# Altium project SlimeVR_REVTT.PrjPcb
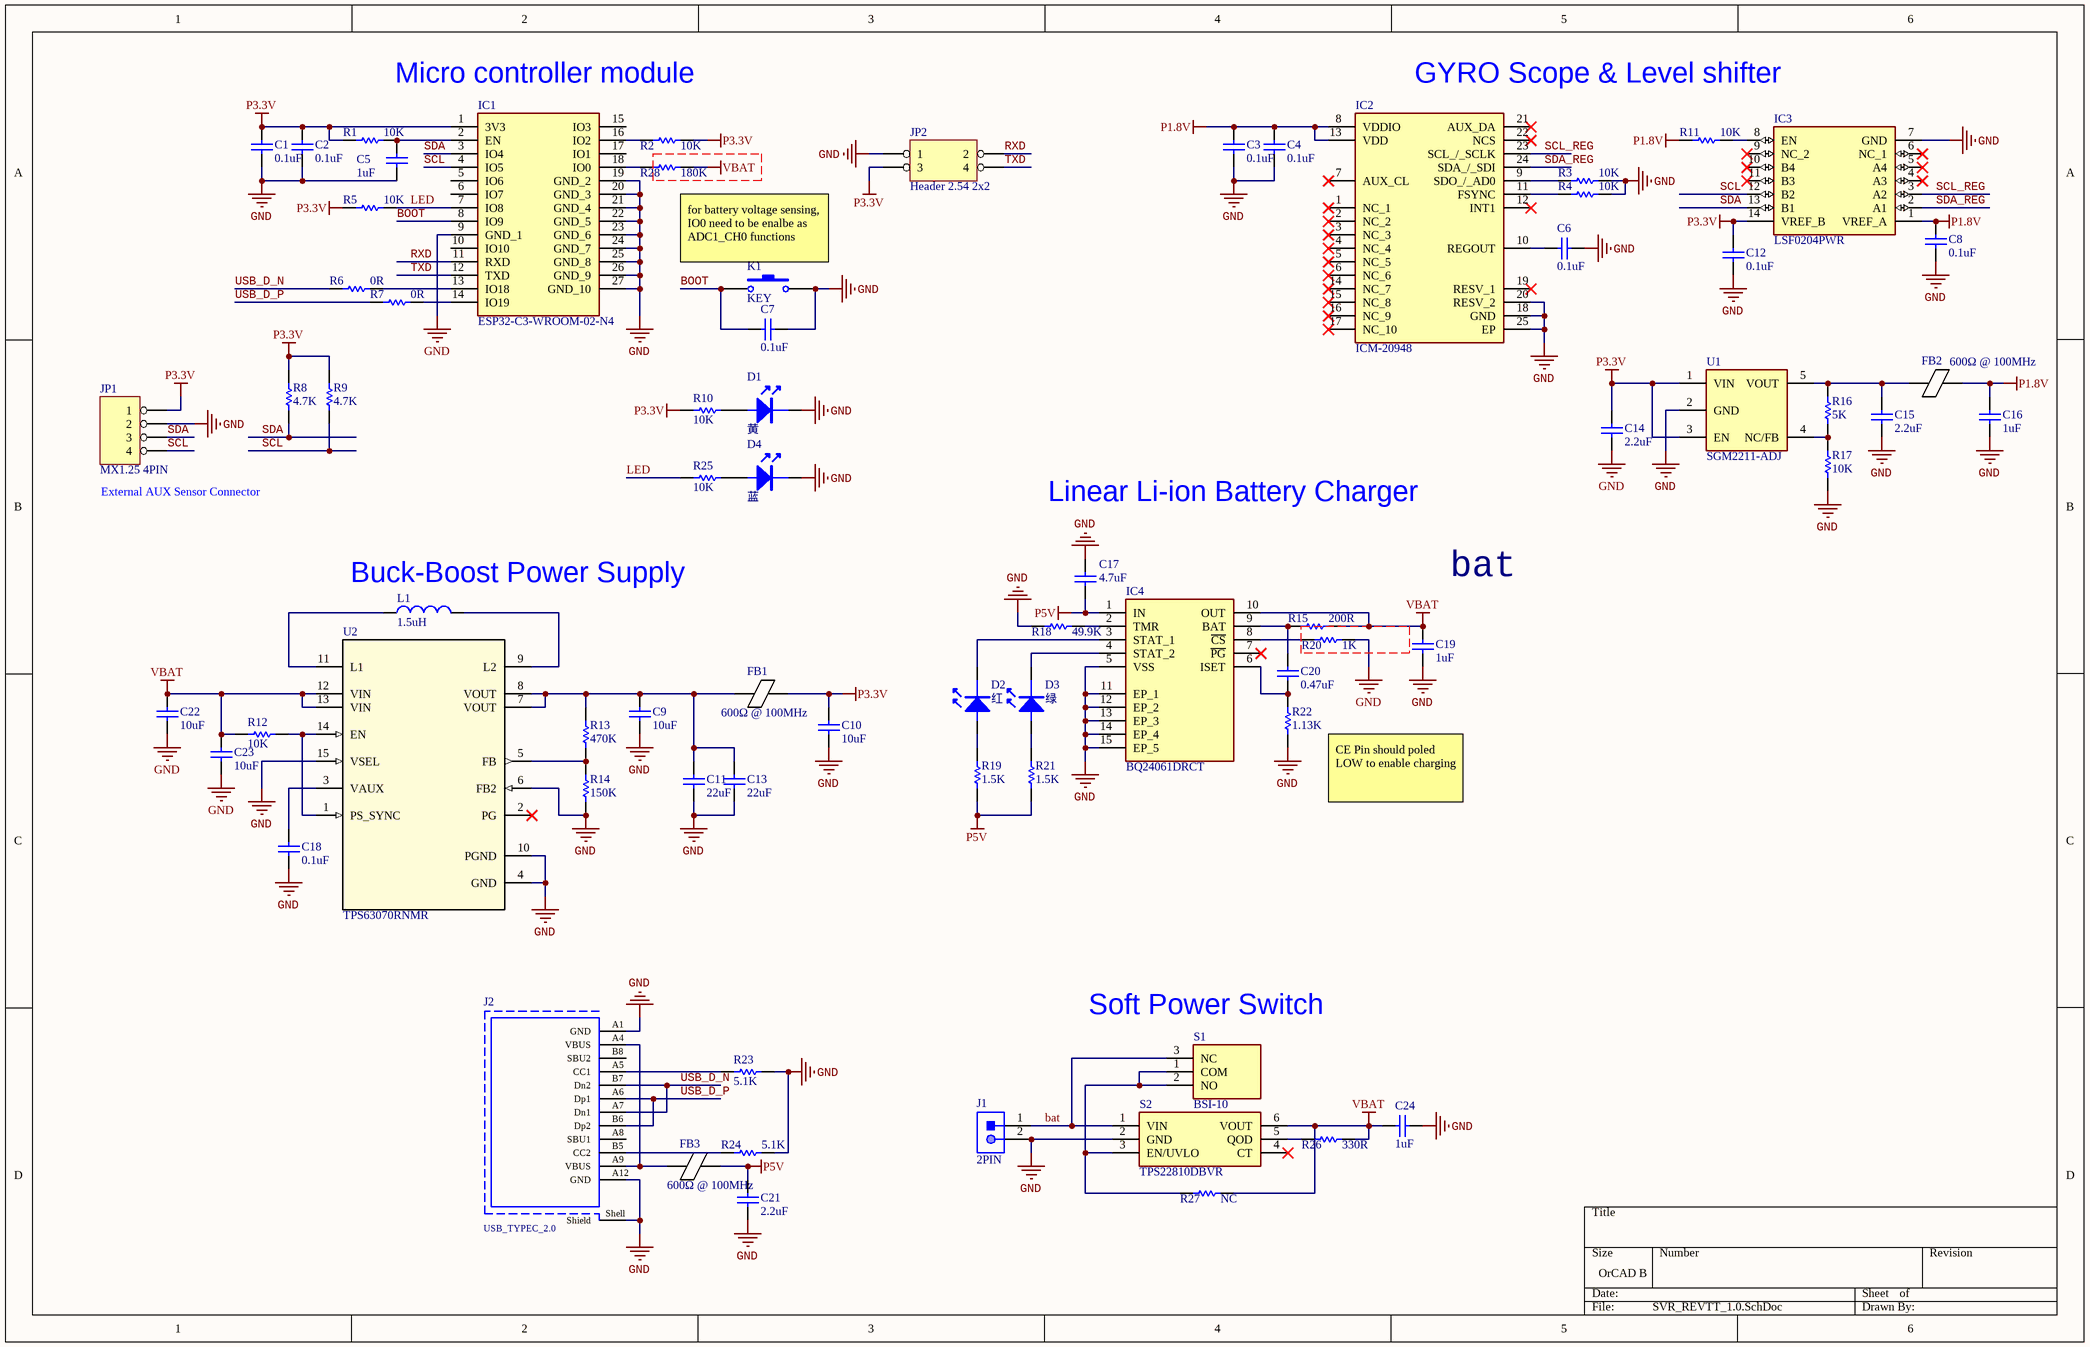
[diagram p0: SVR_REVTT_1.0.SchDoc]
1 sheet, 73 parts. Net scope: global (net labels, ports and power ports of the same name join across sheets).
Board file: SLMVR_REVTT.PcbDoc

## Sheet SVR_REVTT_1.0.SchDoc
size OrCAD B

### Parts
C1  0.1uF  [0603_C]
C2  0.1uF  [0603_C]
C3  0.1uF  [0603_C]
C4  0.1uF  [0603_C]
C5  1uF  [0603_C]
C6  0.1uF  [0603_C]
C7  0.1uF  [0603_C]
C8  0.1uF  [0603_C]
C9  10uF  [0603_C]
C10  10uF  [0805]
C11  22uF  [0805]
C12  0.1uF  [0603_C]
C13  22uF  [0805]
C14  2.2uF  [0603_C]
C15  2.2uF  [0603_C]
C16  1uF  [0603_C]
C17  4.7uF  [0603_C]
C18  0.1uF  [0603_C]
C19  1uF  [0603_C]
C20  0.47uF  [0603_C]
C21  2.2uF  [0603_C]
C22  10uF  [0805]
C23  10uF  [0805]
C24  1uF  [0603_C]
D1  黄  [0603_LED]
D2  红  [0603_LED]
D3  绿  [0603_LED]
D4  蓝  [0603_LED]
FB1  600Ω @ 100MHz  [0805]
FB2  600Ω @ 100MHz  [0603]
FB3  600Ω @ 100MHz  [0603]
IC1  ESP32-C3-WROOM-02-N4  [ESP32C3WROOM02N4]
IC2  ICM-20948  [QFN40P300X300X105-25N-D]
IC3  LSF0204PWR  [SOP65P640X120-14N]
IC4  BQ24061DRCT  [BQ24060DRCT]
J1  2PIN  [XH2.54-WI-2P]
J2  USB_TYPEC_2.0  [USB_TYPEC_2.0_Horizontal_SMT]
JP1  MX1.25 4PIN  [MX 1.25-WS-4P]
JP2  Header 2.54 2x2  [header2X2]
K1  KEY  [KEY_2]
L1  value 1.5uH  [L 1812]  (hidden comment: INDUCTOR)
R1  10K  [0603_R]
R2  10K  [0603_R]
R3  10K  [0603_R]
R4  10K  [0603_R]
R5  10K  [0603_R]
R6  0R  [0603_R]
R7  0R  [0603_R]
R8  4.7K  [0603_R]
R9  4.7K  [0603_R]
R10  10K  [0603]
R11  10K  [0603_R]
R12  10K  [0603_R]
R13  470K  [0603_R]
R14  150K  [0603_R]
R15  200R  [0603_R]
R16  5K  [0603]
R17  10K  [0603]
R18  49.9K  [0603_R]
R19  1.5K  [0603_R]
R20  1K  [0603_R]
R21  1.5K  [0603_R]
R22  1.13K  [0603_R]
R23  5.1K  [0603]
R24  5.1K  [0603]
R25  10K  [0603]
R26  330R  [0603_R]
R27  NC  [0805]
R28  180K  [0603_R]
S1  BSI-10  [BSI10]
S2  TPS22810DBVR  [SOT95P280X145-6N]
U1  SGM2211-ADJ  [SOT-23-5]
U2  TPS63070RNMR  [RNM0015A]

### Nets
GND: C1.1 C2.1 C3.2 C4.2 C5.1 C6.1 C7.2 C8.2 C9.1 C10.1 C11.1 C12.2 C13.1 C14.1 C15.1 C16.1 C17.1 C18.2 C19.2 C21.1 C22.1 C23.1 C24.2 D1.1(K) D4.1(K) IC1.9(GND_1) IC1.19(GND_2) IC1.20(GND_3) IC1.21(GND_4) IC1.22(GND_5) IC1.23(GND_6) IC1.24(GND_7) IC1.25(GND_8) IC1.26(GND_9) IC1.27(GND_10) IC2.18(GND) IC2.20(RESV_2) IC2.25(EP) IC3.7(GND) IC4.5(VSS) IC4.11(EP_1) IC4.12(EP_2) IC4.13(EP_3) IC4.14(EP_4) IC4.15(EP_5) J1.2 J2.A1(GND) J2.A12(GND) J2.Shell(Shield) JP1.2 JP2.1 K1.2 R3.2 R4.2 R14.2 R17.1 R18.2 R20.1 R22.1 R23.2 R24.2 S2.2(GND) U1.2(GND) U2.4(GND) U2.6(FB2) U2.10(PGND) U2.15(VSEL)
P1.8V: C3.1 C4.1 C8.1 C16.2 FB2.2 IC2.8(VDDIO) IC2.13(VDD) IC3.1(VREF_A) R11.1
P3.3V: C1.2 C2.2 C10.2 C12.1 C14.2 FB1.2 IC1.1(3V3) IC3.14(VREF_B) JP1.1 JP2.3 R1.1 R2.2 R5.1 R8.2 R9.2 R10.1 U1.1(VIN) U1.3(EN)
P5V: C17.2 C21.2 FB3.2 IC4.1(IN) R19.2 R21.2
VBAT: C19.1 C22.2 C23.2 C24.1 IC4.10(OUT) R12.2 R15.1 R26.2 R27.2 R28.2 S2.6(VOUT) U2.12(VIN) U2.13(VIN)
bat: J1.1 S1.3(NC) S2.1(VIN)
BOOT: C7.1 IC1.8(IO9) K1.1
LED: IC1.7(IO8) R5.2 R25.1
RXD: IC1.11(RXD) JP2.2
SCL: IC1.4(IO5) IC3.12(B2) JP1.4 R9.1
SCL_REG: IC2.23(SCL_/_SCLK) IC3.3(A2)
SDA: IC1.3(IO4) IC3.13(B1) JP1.3 R8.1
SDA_REG: IC2.24(SDA_/_SDI) IC3.2(A1)
TXD: IC1.12(TXD) JP2.4
USB_D_N: J2.A7(Dn1) J2.B7(Dn2) R6.1
USB_D_P: J2.A6(Dp1) J2.B6(Dp2) R7.1
NetC5_2: C5.2 IC1.2(EN) R1.2
NetC6_2: C6.2 IC2.10(REGOUT)
NetC9_2: C9.2 C11.2 C13.2 FB1.1 R13.1 U2.7(VOUT) U2.8(VOUT)
NetC15_2: C15.2 FB2.1 R16.2 U1.5(VOUT)
NetC18_1: C18.1 U2.3(VAUX)
NetC20_1: C20.1 IC4.6(ISET) R22.2
NetC20_2: C20.2 IC4.9(BAT) R15.2
NetD1_2: D1.2(A) R10.2
NetD2_1: D2.1(K) IC4.3(STAT_1)
NetD2_2: D2.2(A) R19.1
NetD3_1: D3.1(K) IC4.4(STAT_2)
NetD3_2: D3.2(A) R21.1
NetD4_2: D4.2(A) R25.2
NetFB3_1: FB3.1 J2.A4(VBUS) J2.A9(VBUS)
NetIC1_13: IC1.13(IO18) R6.2
NetIC1_14: IC1.14(IO19) R7.2
NetIC1_16: IC1.16(IO2) R2.1
NetIC1_18: IC1.18(IO0) R28.1
NetIC2_9: IC2.9(SDO_/_AD0) R3.1
NetIC2_11: IC2.11(FSYNC) R4.1
NetIC3_8: IC3.8(EN) R11.2
NetIC4_2: IC4.2(TMR) R18.1
NetIC4_8: IC4.8(~{CS}) R20.2
NetJ2_A5: J2.A5(CC1) R23.1
NetJ2_B5: J2.B5(CC2) R24.1
NetL1_1: L1.1 U2.11(L1)
NetL1_2: L1.2 U2.9(L2)
NetR12_1: R12.1 U2.1(PS_SYNC) U2.14(EN)
NetR13_2: R13.2 R14.1 U2.5(FB)
NetR16_1: R16.1 R17.2 U1.4(NC/FB)
NetR26_1: R26.1 S2.5(QOD)
NetR27_1: R27.1 S1.1(COM) S1.2(NO) S2.3(EN/UVLO)

Not connected (* = marked no-connect by the designer): IC1 5(IO6) 6(IO7) 10(IO10) 15(IO3) 17(IO1); IC2 1(NC_1)* 2(NC_2)* 3(NC_3)* 4(NC_4)* 5(NC_5)* 6(NC_6)* 7(AUX_CL)* 12(INT1)* 14(NC_7)* 15(NC_8)* 16(NC_9)* 17(NC_10)* 19(RESV_1)* 21(AUX_DA)* 22(NCS)*; IC3 4(A3)* 5(A4)* 6(NC_1)* 9(NC_2)* 10(B4)* 11(B3)*; IC4 7(~{PG})*; J2 A8(SBU1) B8(SBU2); S2 4(CT)*; U2 2(PG)*

### Notes on the sheet
- Micro controller module
- GYRO Scope & Level shifter
- for battery voltage sensing, IO0 need to be enalbe as ADC1_CH0 functions
- (near JP1) External AUX Sensor Connector
- Linear Li-ion Battery Charger
- (near L1) Buck-Boost Power Supply
- bat
- (near R22) CE Pin should poled LOW to enable charging
- (near S1) Soft Power Switch

### Library data of the parts
C1-C24 = CAP: Capacitor; Value: 104; Published: 8-Jun-2000; LatestRevisionDate: 17-Jul-2002; LatestRevisionNote: Re-released for DXP Platform.; PackageReference: RAD-0.3; Publisher: Altium Limited
D1-D4 = LED: LED 发光二极管
FB1-FB3 = FB: 磁珠 600Ω @ 100MHz
IC1 = ESP32-C3-WROOM-02-N4: Integrated Circuit; Manufacturer_Name: Espressif Systems; Datasheet Link: https://www.mouser.ch/datasheet/2/891/Espressif_ESP32_C3_WROOM_02-2006871.pdf; Height: 3.35mm; Manufacturer_Part_Number: ESP32-C3-WROOM-02-N4; Mouser Part Number: 356-ESP32C3WROOM02N4; Mouser Price/Stock: https://www.mouser.co.uk/ProductDetail/Espressif-Systems/ESP32-C3-WROOM-02-N4?qs=stqOd1AaK7%2FqjTZKEOgfUg%3D%3D
IC2 = ICM-20948: Integrated Circuit; Manufacturer_Name: TDK; Datasheet Link: https://product.tdk.com/system/files/dam/doc/product/sensor/mortion-inertial/imu/data_sheet/ds-000189-icm-20948-v1.3.pdf; Height: 1.05mm; Manufacturer_Part_Number: ICM-20948; Mouser Part Number: 410-ICM-20948; Mouser Price/Stock: https://www.mouser.co.uk/ProductDetail/TDK-InvenSense/ICM-20948?qs=u4fy%2FsgLU9OtGc31yF%2Friw%3D%3D; Arrow Part Number: ICM-20948; Arrow Price/Stock: https://www.arrow.com/en/products/icm-20948/invensense?region=nac
IC3 = LSF0204PWR: Integrated Circuit; Manufacturer_Name: Texas Instruments; Datasheet Link: http://www.ti.com/lit/gpn/lsf0204; Height: 1.2mm; Manufacturer_Part_Number: LSF0204PWR; Mouser Part Number: 595-LSF0204PWR; Mouser Price/Stock: https://www.mouser.co.uk/ProductDetail/Texas-Instruments/LSF0204PWR?qs=m%2F7bTylgptck0MkFZrWcVg%3D%3D; Arrow Part Number: LSF0204PWR; Arrow Price/Stock: https://www.arrow.com/en/products/lsf0204pwr/texas-instruments?region=nac
IC4 = BQ24060DRCT: Integrated Circuit; Manufacturer_Name: Texas Instruments; Datasheet Link: https://www.ti.com/lit/gpn/bq24060; Height: 1mm; Manufacturer_Part_Number: BQ24060DRCT
J1 = HEADER 2PIN
J2 = USB_TYPEC_2.0: USB 3.1 Type C Receptacle WR-COM, Horizontal, SMT / THT; Part Number: 632723300011; Rated Current: 5 A; Contact Resistance: 30 mOhm; Working Voltage: 20 VDC; ComponentLink1Description: Manufacturer; ComponentLink1URL: http://www.we-online.de; ComponentLink2Description: Datasheet; ComponentLink2URL: https://katalog.we-online.de/em/datasheet/632723x00011%282%29.pdf; Published Date: September 2018; Publisher: Wurth Elektronik; Orientation: Horizontal; Connector Type: USB 3.1 Type C; Operating Temperature: -40 to 105 degC; Mounting Technology: SMT / THT; Gender: Receptacle; Packaging: Tape and Reel
JP1 = HEADER 4
JP2 = HEADER 2X2
K1 = KEY_2: Switch; Published: 24-Mar-1999; LatestRevisionDate: 17-Jul-2002; LatestRevisionNote: Re-released for DXP Platform.; PackageReference: SPST-2; Publisher: Altium Limited
L1 = INDUCTOR: 电感; Code_IEC: 1005; Published: 8-Jun-2000; LatestRevisionDate: 17-Jul-2002; LatestRevisionNote: Re-released for DXP Platform.; PackageReference: 0402-A; Publisher: Altium Limited; Code_JEITA: 0402
R1-R19 R21-R28 = RES: Resistor; Value: 1K; Published: 8-Jun-2000; Revision: July-2002: Re-released for DXP Platform.; Publisher: Altium Limited
R20 = RES: Resistor; Published: 8-Jun-2000; Revision: July-2002: Re-released for DXP Platform.; Publisher: Altium Limited; Value: 1K
S1 = BSI-10: Switch; Manufacturer_Name: Sungmun; Datasheet Link: https://datasheet.datasheetarchive.com/originals/distributors/Datasheets-2/DSA-20618.pdf; Height: 6.4mm; Manufacturer_Part_Number: BSI-10
S2 = TPS22810DBVR: Switch; Manufacturer_Name: Texas Instruments; Datasheet Link: http://www.ti.com/lit/gpn/tps22810; Height: 1.45mm; Manufacturer_Part_Number: TPS22810DBVR; Mouser Part Number: 595-TPS22810DBVR; Mouser Price/Stock: https://www.mouser.co.uk/ProductDetail/Texas-Instruments/TPS22810DBVR?qs=34RfhUjJmKcFqeJVMZZhPA%3D%3D; Arrow Part Number: TPS22810DBVR; Arrow Price/Stock: https://www.arrow.com/en/products/tps22810dbvr/texas-instruments?region=nac
U1 = ADP150
U2 = TPS63070RNMR: Imported; Manufacturer: Texas Instruments; PartNumber: TPS63070RNMR; RefDes: RefDes; Type: TYPE; Value: Value